# Altium project 7805.PrjPcb
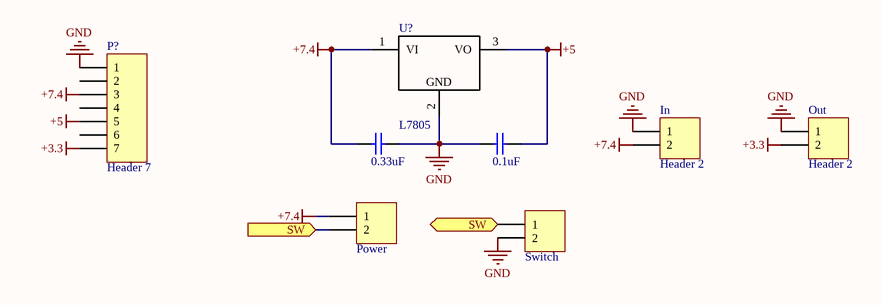
[diagram p0: 7805-2.SchDoc]
1 sheet, 8 parts. Net scope: flat (ports and power ports of the same name join across sheets).
Board file: 7805-2.PcbDoc

## Sheet 7805-2.SchDoc
size A4

### Parts
0.1uF  0.1uF  [My_cap100n]
0.33uF  0.33uF  [My_cap100n]
In  Header 2  [HDR1X2]
Out  Header 2  [HDR1X2]
P?  Header 7  [HDR1X7]
Power  Power Connector  [My_ Power_Connector]  (value not drawn)
Switch  Power Connector  [My_ Power_Connector]  (value not drawn)
U?  L7805  [to220-123-v]

### Ports
SW (in), SW (out)

### Nets
+3.3: Out.2 P?.7
+5: 0.1uF.2 P?.5 U?.3(VO)
+7.4: 0.33uF.1 In.2 P?.3 Power.1 U?.1(VI)
GND: 0.1uF.1 0.33uF.2 In.1 Out.1 P?.1 Switch.2 U?.2
NetPower_2: Power.2 Switch.1 ; port SW

Not connected (* = marked no-connect by the designer): P? 2 4 6

### Notes on the sheet
- (in symbol L7805-TO220) GND

### Library data of the parts
0.1uF 0.33uF = Cap ceramic: CAP-100Nf; Value: 100nF
In Out = Header 2: Header, 2-Pin; LatestRevisionDate: 17-Jul-2002; LatestRevisionNote: Re-released for DXP Platform.; Publisher: Altium Limited
P? = Header 7: Header, 7-Pin; LatestRevisionDate: 17-Jul-2002; LatestRevisionNote: Re-released for DXP Platform.; Publisher: Altium Limited
Power Switch = Power Connector: white Power Connector
U? = L7805-TO220: LINEAR REGULATOR 5.0V; Supplier 1: Mouser; Supplier Part Number 1: 511-L7805ACP